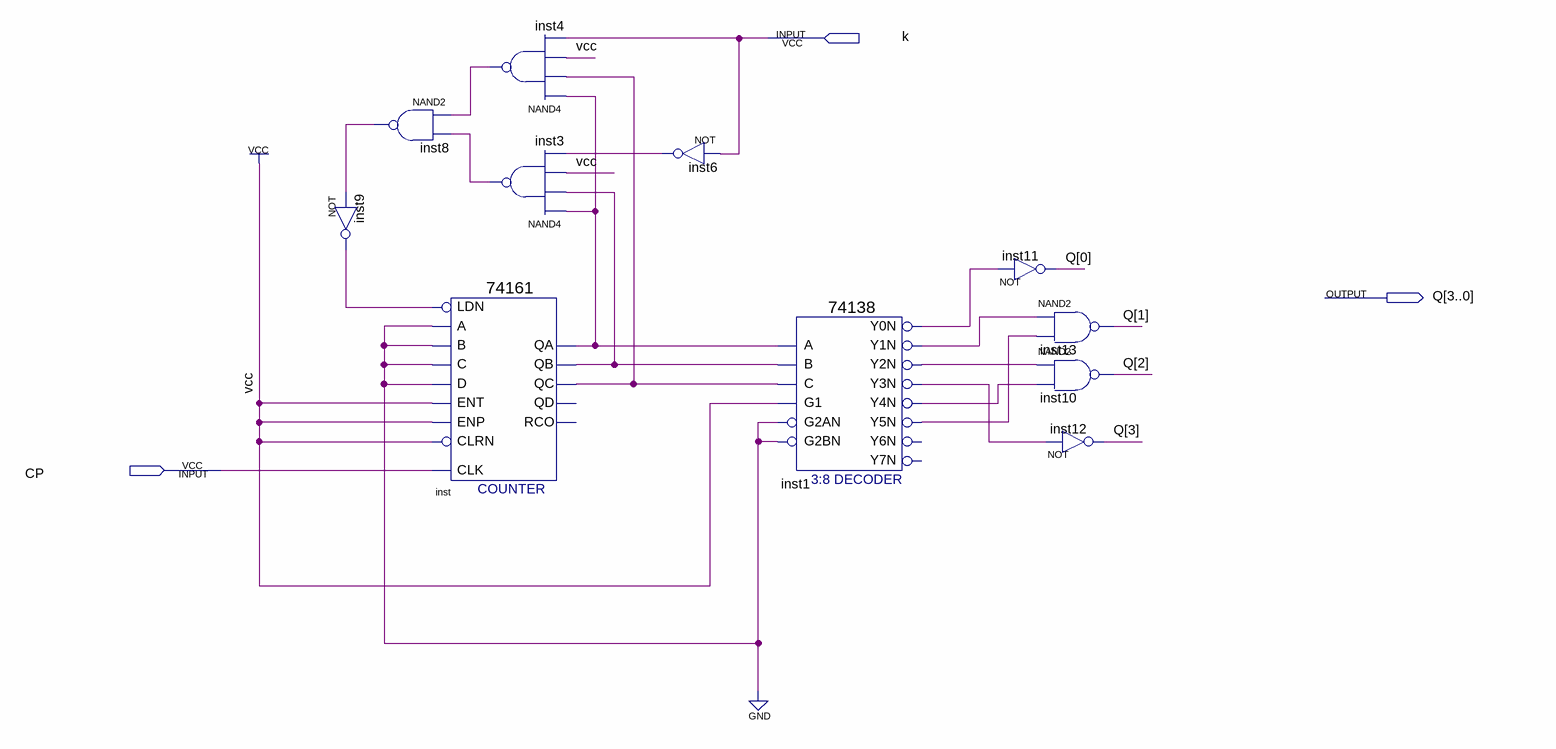
[diagram p0: schematic sheet]
// Quartus schematic liushuideng.bdf as structural Verilog: 11 symbols, 3 pins
module liushuideng (
  input  k,
  input  CP,
  output [3:0] Q
);

  wire inst1_y0n, inst1_y1n, inst1_y2n, inst1_y3n, inst1_y4n, inst1_y5n, inst3_out, inst4_out, inst6_out,
       inst8_out, inst9_out, inst_qa, inst_qb, inst_qc;

  not inst9 (inst9_out, inst8_out);
  nand inst8 (inst8_out, inst4_out, inst3_out);
  \74161  inst (
    .CLRN(1'b1), .CLK(CP), .ENP(1'b1), .LDN(inst9_out), .A(1'b0), .D(1'b0), .ENT(1'b1), .B(1'b0), .C(1'b0),
    .QC(inst_qc), .QB(inst_qb), .QA(inst_qa));  // open: QD, RCO
  nand inst4 (inst4_out, inst_qa, inst_qc, 1'b1, k);
  nand inst3 (inst3_out, inst_qa, inst_qb, 1'b1, inst6_out);
  not inst6 (inst6_out, k);
  \74138  inst1 (
    .A(inst_qa), .B(inst_qb), .G1(1'b1), .C(inst_qc), .G2AN(1'b0), .G2BN(1'b0), .Y0N(inst1_y0n),
    .Y1N(inst1_y1n), .Y2N(inst1_y2n), .Y3N(inst1_y3n), .Y4N(inst1_y4n), .Y5N(inst1_y5n));  // open: Y6N, Y7N
  not inst11 (Q[0], inst1_y0n);
  nand inst13 (Q[1], inst1_y1n, inst1_y5n);
  nand inst10 (Q[2], inst1_y2n, inst1_y4n);
  not inst12 (Q[3], inst1_y3n);
endmodule
